# EAGLE schematic ModuleInterconnect (EAGLE 9.6.2)
FacetHound release module interconnect. Electrical harness only; no board association. See INTERCONNECT.md for MODE pins and encoder notes.

## Sheet 1 of 6: BASE TO MAST - 115200 baud, 3.3 V UART
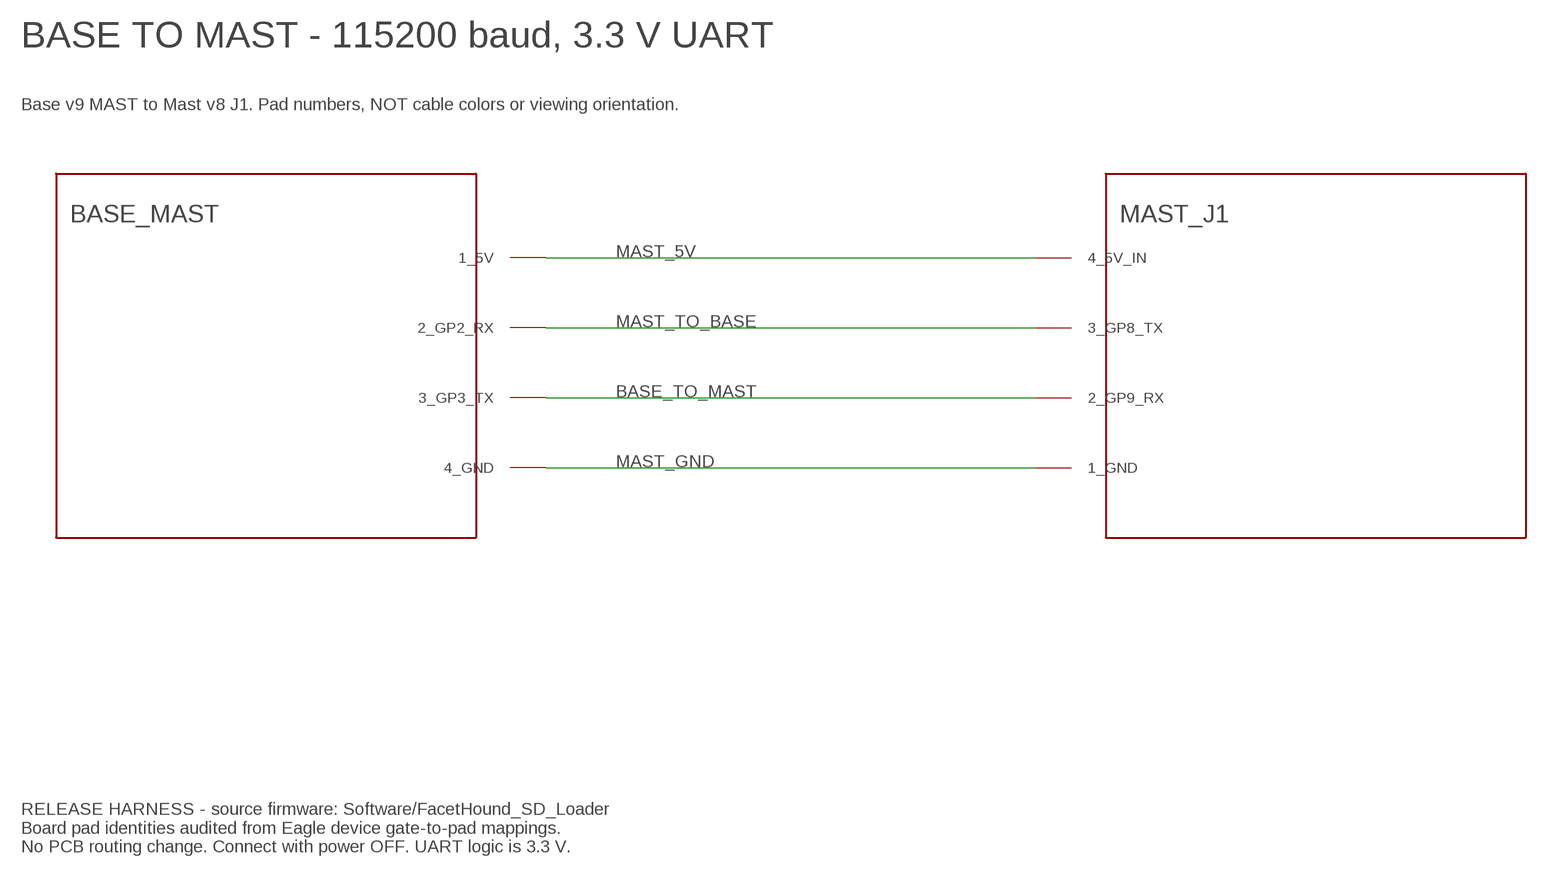
[diagram p0: schematic, sheet 1]

### Parts
BASE_MAST  S0L  (no package)
MAST_J1  S0R  (no package)

### Nets
BASE_TO_MAST: BASE_MAST.3_GP3_TX MAST_J1.2_GP9_RX
MAST_5V: BASE_MAST.1_5V MAST_J1.4_5V_IN
MAST_GND: BASE_MAST.4_GND MAST_J1.1_GND
MAST_TO_BASE: BASE_MAST.2_GP2_RX MAST_J1.3_GP8_TX

### Notes on the sheet
- BASE TO MAST - 115200 baud, 3.3 V UART
- Base v9 MAST to Mast v8 J1. Pad numbers, NOT cable colors or viewing orientation.
- RELEASE HARNESS - source firmware: Software/FacetHound_SD_Loader
  Board pad identities audited from Eagle device gate-to-pad mappings.
  No PCB routing change. Connect with power OFF. UART logic is 3.3 V.

## Sheet 2 of 6: BASE TO DISPLAY - 460800 baud, 3.3 V UART
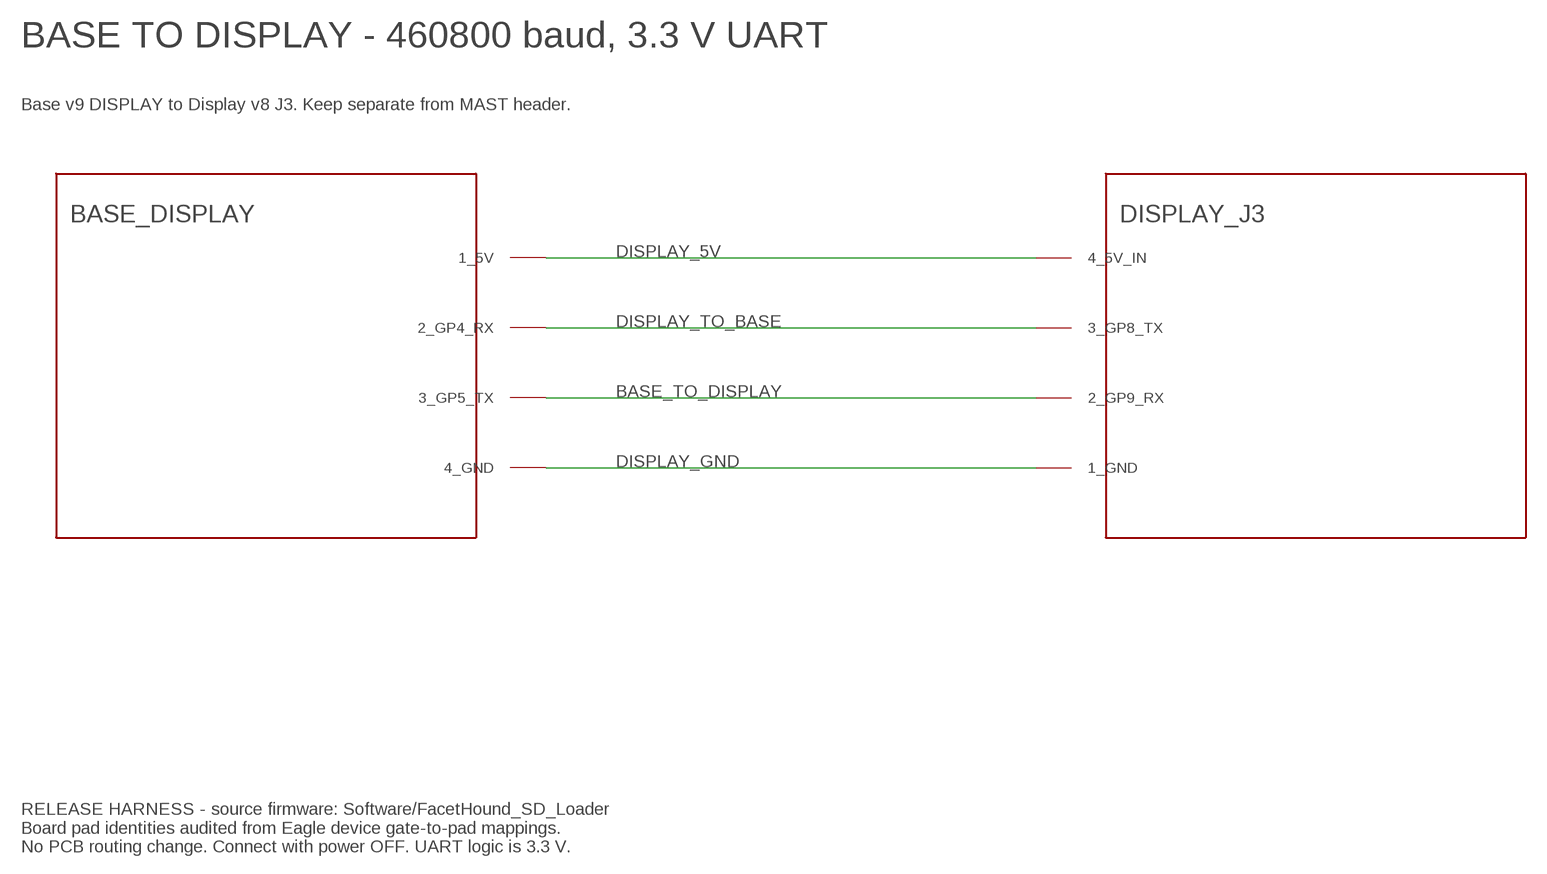
[diagram p1: schematic, sheet 2]

### Parts
BASE_DISPLAY  S1L  (no package)
DISPLAY_J3  S1R  (no package)

### Nets
BASE_TO_DISPLAY: BASE_DISPLAY.3_GP5_TX DISPLAY_J3.2_GP9_RX
DISPLAY_5V: BASE_DISPLAY.1_5V DISPLAY_J3.4_5V_IN
DISPLAY_GND: BASE_DISPLAY.4_GND DISPLAY_J3.1_GND
DISPLAY_TO_BASE: BASE_DISPLAY.2_GP4_RX DISPLAY_J3.3_GP8_TX

### Notes on the sheet
- BASE TO DISPLAY - 460800 baud, 3.3 V UART
- Base v9 DISPLAY to Display v8 J3. Keep separate from MAST header.
- RELEASE HARNESS - source firmware: Software/FacetHound_SD_Loader
  Board pad identities audited from Eagle device gate-to-pad mappings.
  No PCB routing change. Connect with power OFF. UART logic is 3.3 V.

## Sheet 3 of 6: BASE TO KEYBOARD USB HOST - 115200 baud, 3.3 V UART
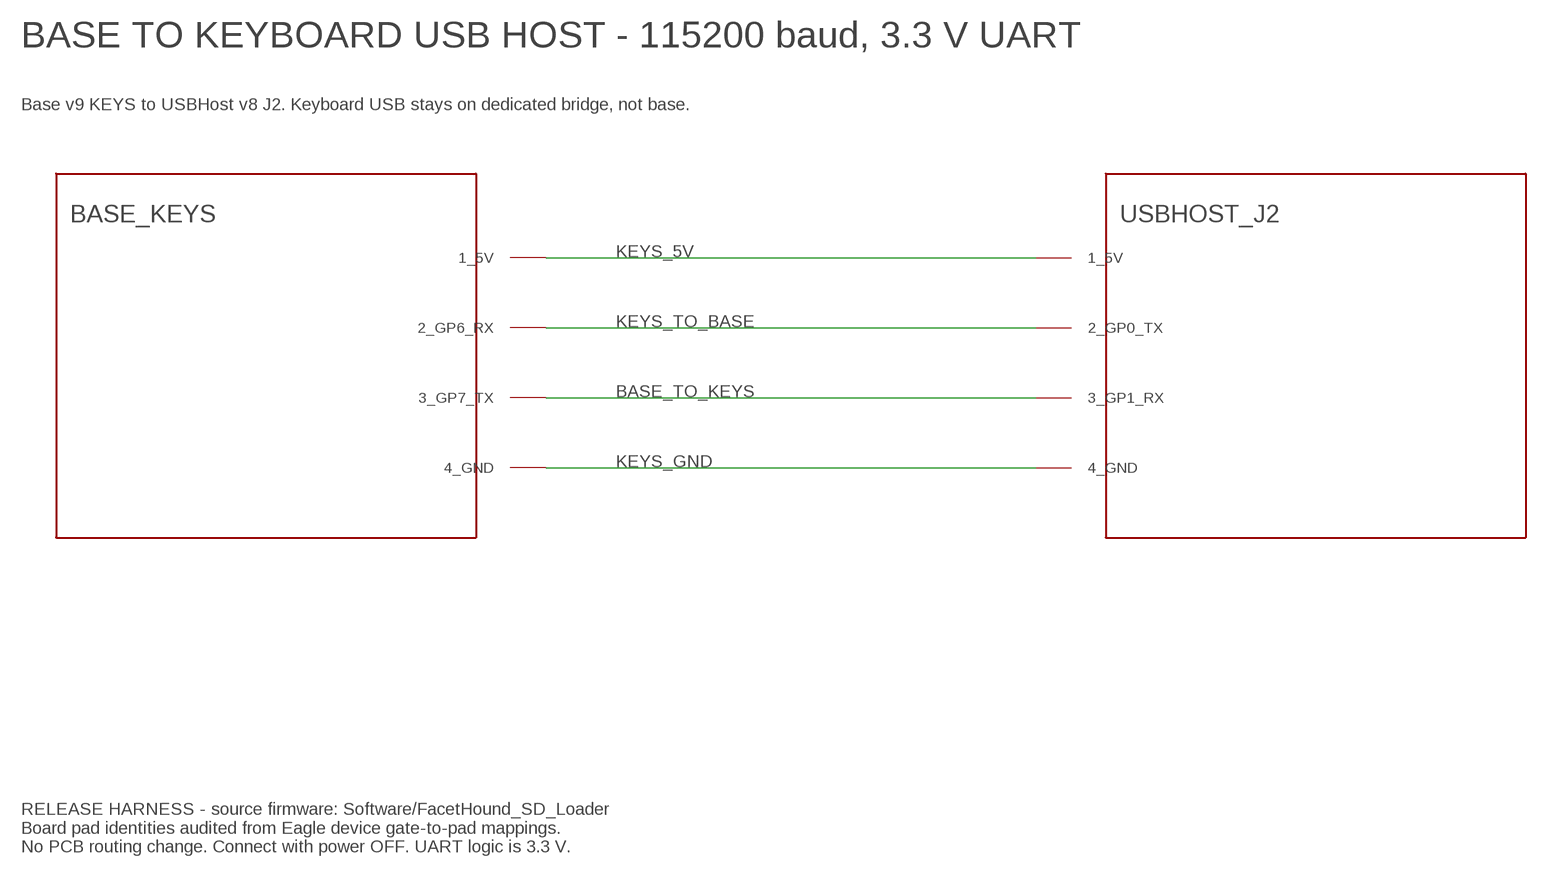
[diagram p2: schematic, sheet 3]

### Parts
BASE_KEYS  S2L  (no package)
USBHOST_J2  S2R  (no package)

### Nets
BASE_TO_KEYS: BASE_KEYS.3_GP7_TX USBHOST_J2.3_GP1_RX
KEYS_5V: BASE_KEYS.1_5V USBHOST_J2.1_5V
KEYS_GND: BASE_KEYS.4_GND USBHOST_J2.4_GND
KEYS_TO_BASE: BASE_KEYS.2_GP6_RX USBHOST_J2.2_GP0_TX

### Notes on the sheet
- BASE TO KEYBOARD USB HOST - 115200 baud, 3.3 V UART
- Base v9 KEYS to USBHost v8 J2. Keyboard USB stays on dedicated bridge, not base.
- RELEASE HARNESS - source firmware: Software/FacetHound_SD_Loader
  Board pad identities audited from Eagle device gate-to-pad mappings.
  No PCB routing change. Connect with power OFF. UART logic is 3.3 V.

## Sheet 4 of 6: BASE TO AUTOMATIC RS485 ADAPTER
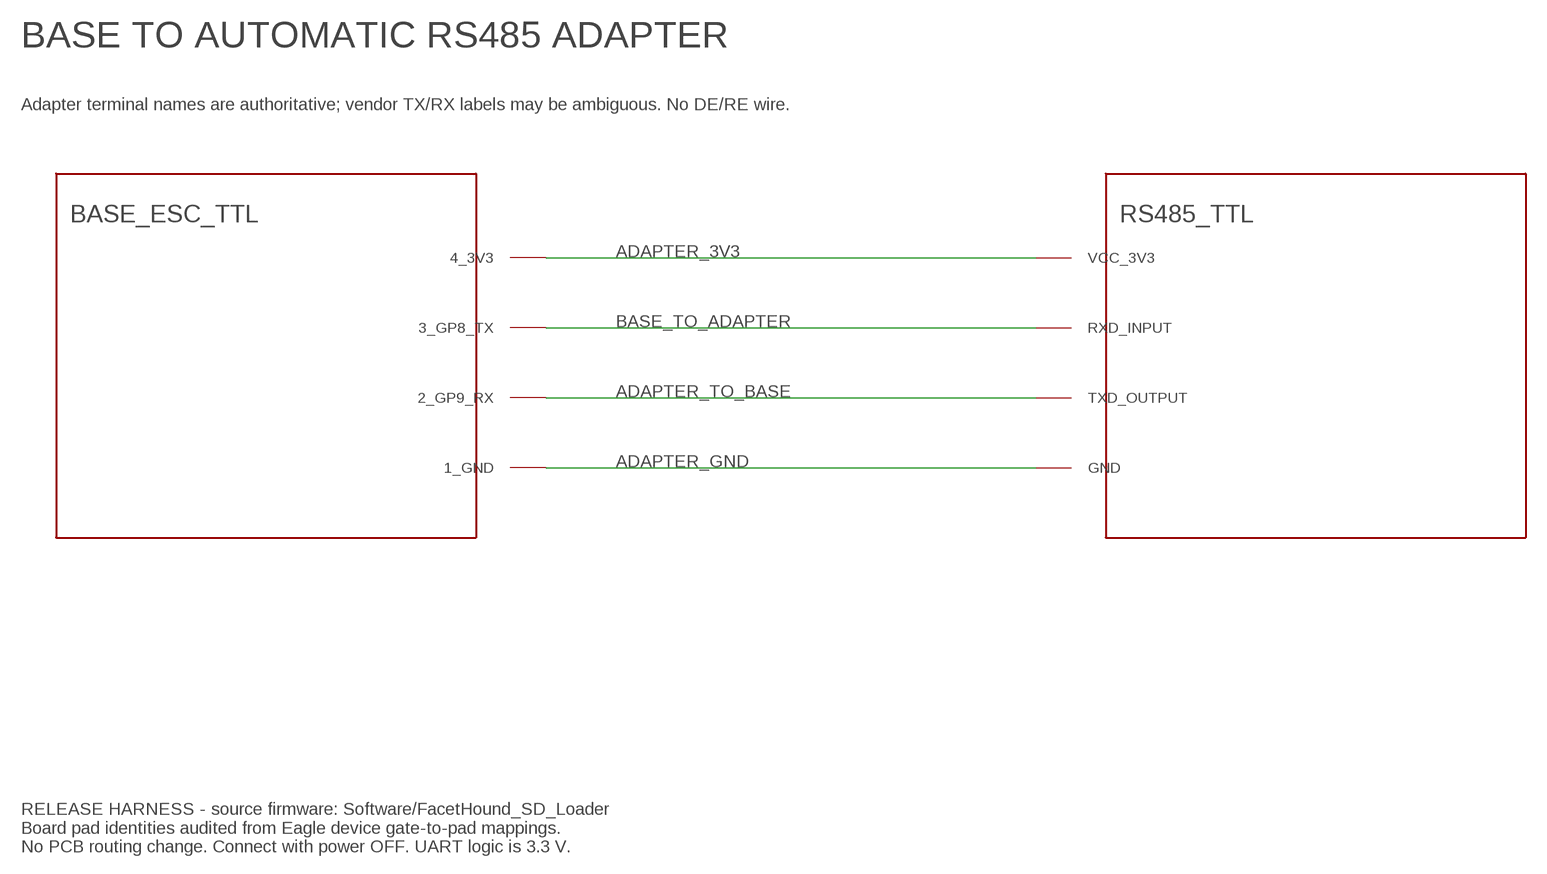
[diagram p3: schematic, sheet 4]

### Parts
BASE_ESC_TTL  S3L  (no package)
RS485_TTL  S3R  (no package)

### Nets
ADAPTER_3V3: BASE_ESC_TTL.4_3V3 RS485_TTL.VCC_3V3
ADAPTER_GND: BASE_ESC_TTL.1_GND RS485_TTL.GND
ADAPTER_TO_BASE: BASE_ESC_TTL.2_GP9_RX RS485_TTL.TXD_OUTPUT
BASE_TO_ADAPTER: BASE_ESC_TTL.3_GP8_TX RS485_TTL.RXD_INPUT

### Notes on the sheet
- BASE TO AUTOMATIC RS485 ADAPTER
- Adapter terminal names are authoritative; vendor TX/RX labels may be ambiguous. No DE/RE wire.
- RELEASE HARNESS - source firmware: Software/FacetHound_SD_Loader
  Board pad identities audited from Eagle device gate-to-pad mappings.
  No PCB routing change. Connect with power OFF. UART logic is 3.3 V.

## Sheet 5 of 6: BASE TO MICROSD SPI - NO CARD DETECT
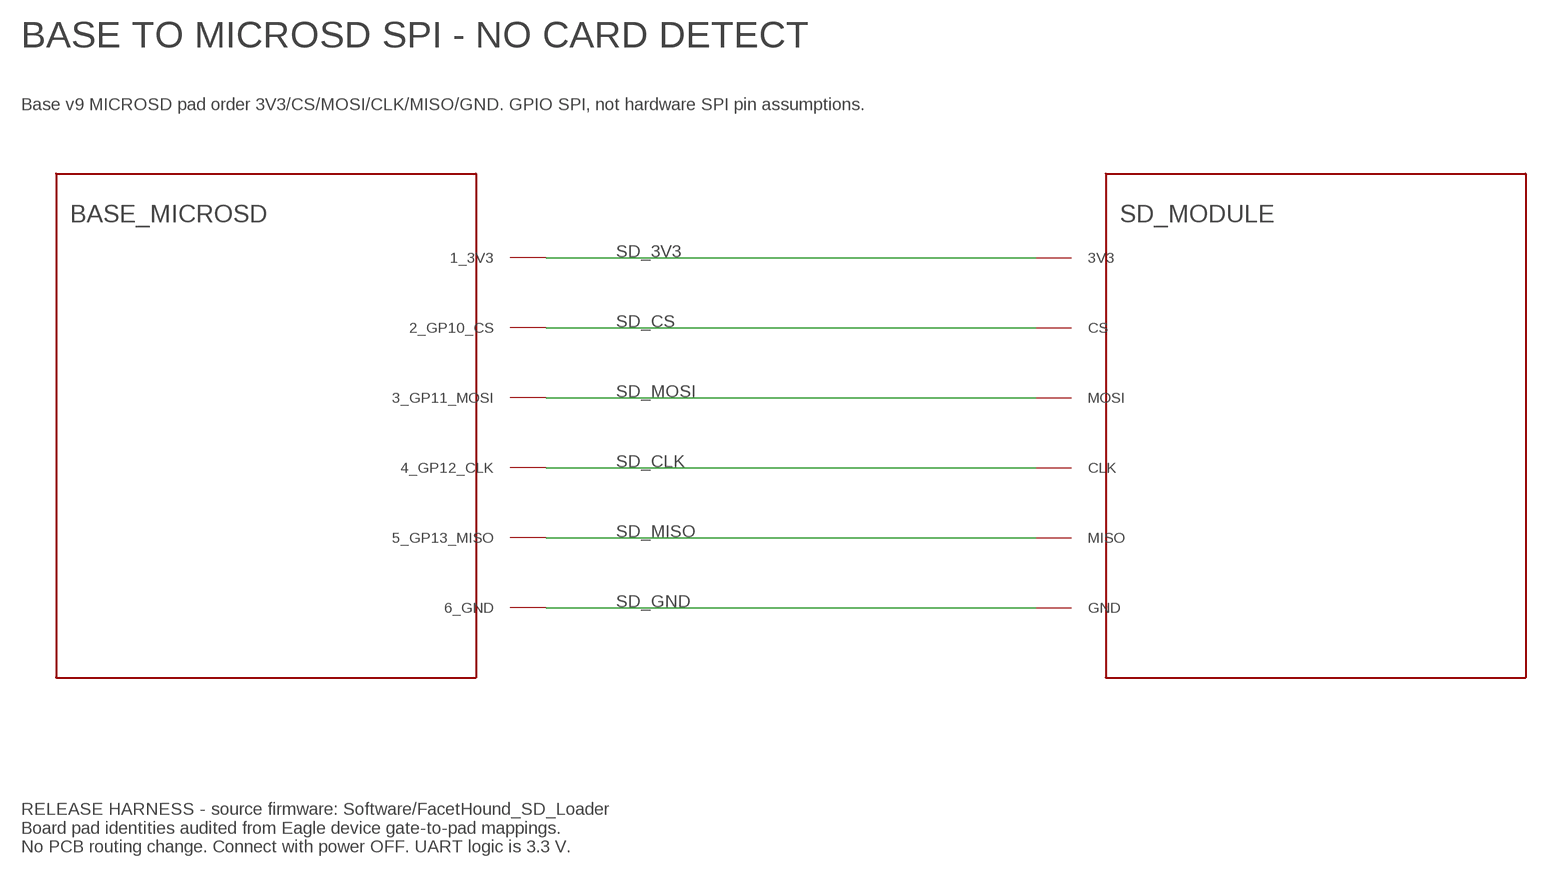
[diagram p4: schematic, sheet 5]

### Parts
BASE_MICROSD  S4L  (no package)
SD_MODULE  S4R  (no package)

### Nets
SD_3V3: BASE_MICROSD.1_3V3 SD_MODULE.3V3
SD_CLK: BASE_MICROSD.4_GP12_CLK SD_MODULE.CLK
SD_CS: BASE_MICROSD.2_GP10_CS SD_MODULE.CS
SD_GND: BASE_MICROSD.6_GND SD_MODULE.GND
SD_MISO: BASE_MICROSD.5_GP13_MISO SD_MODULE.MISO
SD_MOSI: BASE_MICROSD.3_GP11_MOSI SD_MODULE.MOSI

### Notes on the sheet
- BASE TO MICROSD SPI - NO CARD DETECT
- Base v9 MICROSD pad order 3V3/CS/MOSI/CLK/MISO/GND. GPIO SPI, not hardware SPI pin assumptions.
- RELEASE HARNESS - source firmware: Software/FacetHound_SD_Loader
  Board pad identities audited from Eagle device gate-to-pad mappings.
  No PCB routing change. Connect with power OFF. UART logic is 3.3 V.

## Sheet 6 of 6: RS485 ADAPTER TO LAP DRIVE
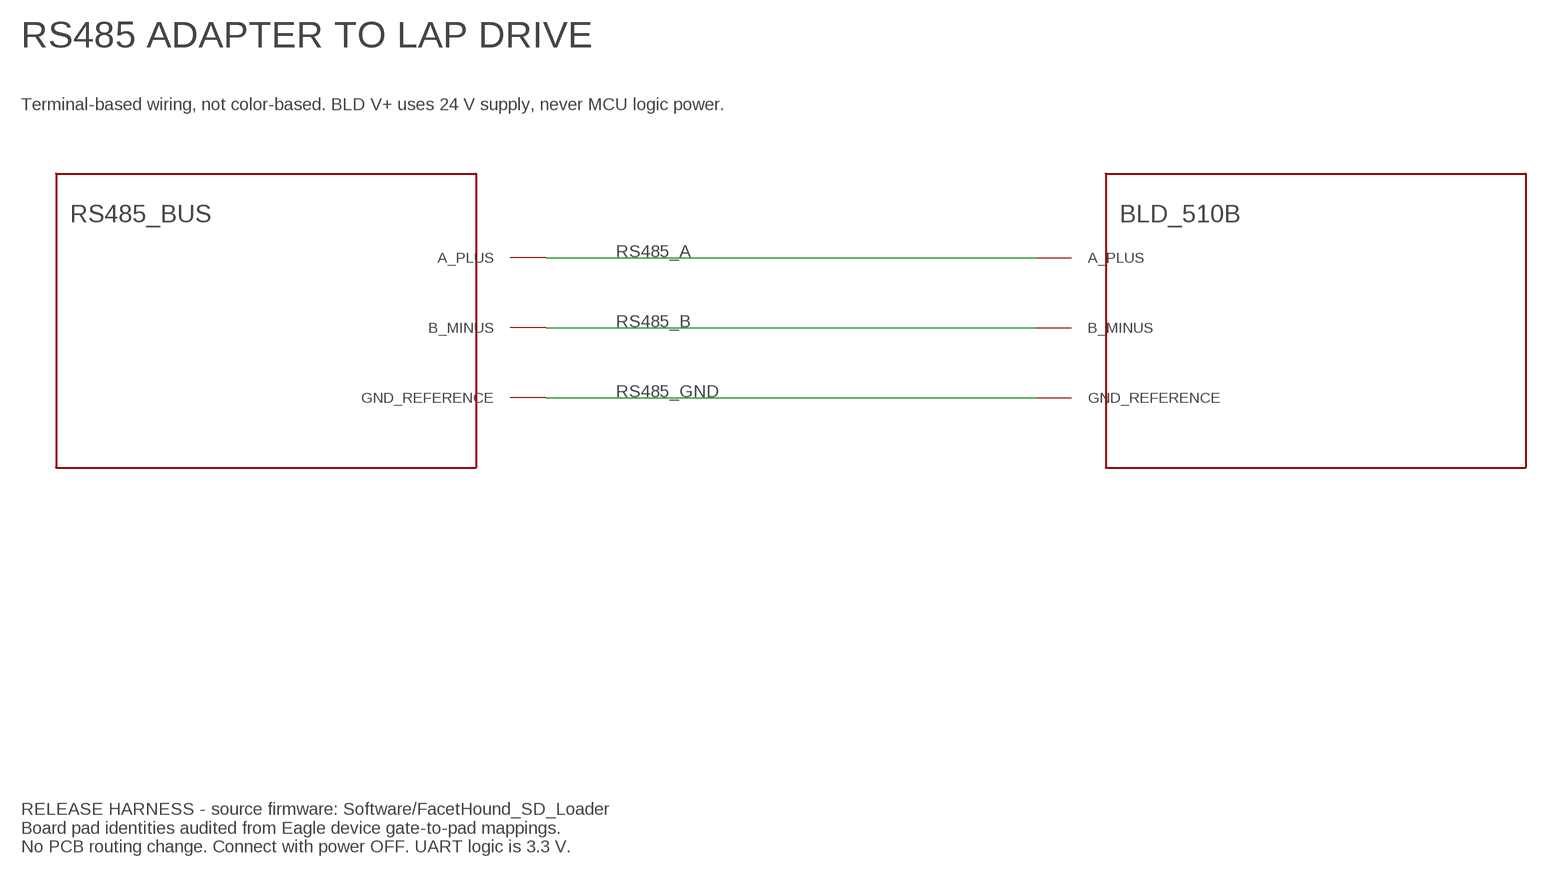
[diagram p5: schematic, sheet 6]

### Parts
BLD_510B  S5R  (no package)
RS485_BUS  S5L  (no package)

### Nets
RS485_A: BLD_510B.A_PLUS RS485_BUS.A_PLUS
RS485_B: BLD_510B.B_MINUS RS485_BUS.B_MINUS
RS485_GND: BLD_510B.GND_REFERENCE RS485_BUS.GND_REFERENCE

### Notes on the sheet
- RS485 ADAPTER TO LAP DRIVE
- Terminal-based wiring, not color-based. BLD V+ uses 24 V supply, never MCU logic power.
- RELEASE HARNESS - source firmware: Software/FacetHound_SD_Loader
  Board pad identities audited from Eagle device gate-to-pad mappings.
  No PCB routing change. Connect with power OFF. UART logic is 3.3 V.

## Library data of the parts
BASE_DISPLAY = FacetHoundInterconnect:S1L
BASE_ESC_TTL = FacetHoundInterconnect:S3L
BASE_KEYS = FacetHoundInterconnect:S2L
BASE_MAST = FacetHoundInterconnect:S0L
BASE_MICROSD = FacetHoundInterconnect:S4L
BLD_510B = FacetHoundInterconnect:S5R
DISPLAY_J3 = FacetHoundInterconnect:S1R
MAST_J1 = FacetHoundInterconnect:S0R
RS485_BUS = FacetHoundInterconnect:S5L
RS485_TTL = FacetHoundInterconnect:S3R
SD_MODULE = FacetHoundInterconnect:S4R
USBHOST_J2 = FacetHoundInterconnect:S2R